# Altium schematic sheet [9]Battery Managment.SchDoc
size B
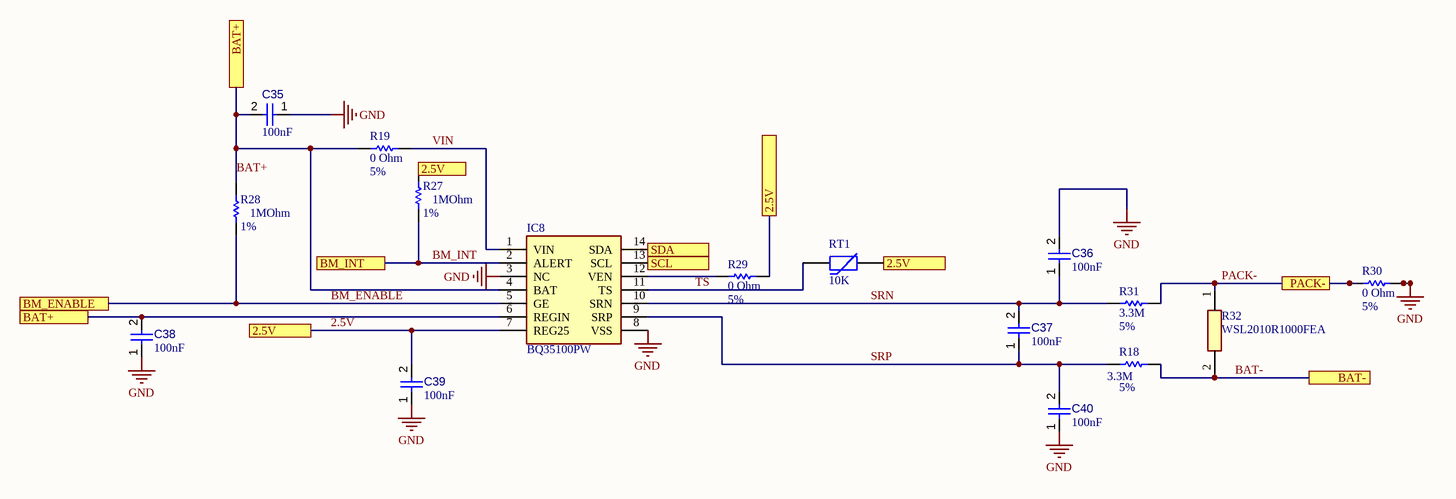
[diagram p0: [9]Battery Managment.SchDoc]

## Parts
C35  value 100nF  [CAPC1608X90X40ML10T20]  (hidden comment: Capacitor 100 nF +/-10% 50 V 0603)
C36  value 100nF  [CAPC1608X90X40ML10T20]  (hidden comment: Capacitor 100 nF +/-10% 50 V 0603)
C37  value 100nF  [CAPC1608X90X40ML10T20]  (hidden comment: Capacitor 100 nF +/-10% 50 V 0603)
C38  value 100nF  [CAPC1608X90X40ML10T20]  (hidden comment: Capacitor 100 nF +/-10% 50 V 0603)
C39  value 100nF  [CAPC1608X90X40ML10T20]  (hidden comment: Capacitor 100 nF +/-10% 50 V 0603)
C40  value 100nF  [CAPC1608X90X40ML10T20]  (hidden comment: Capacitor 100 nF +/-10% 50 V 0603)
IC8  BQ35100PW  [SOP65P640X120-14N]
R18  value 3.3M  Tolerance: 5%  [RES 0603]  (hidden comment: RES 3.3M 5% 0.1W [0603])
R19  value 0 Ohm  Tolerance: 5%  [RES 0603]  (hidden comment: RES 0 Ohm 5% 0.1W [0603])
R27  value 1MOhm  Tolerance: 1%  [RES 0603]  (hidden comment: RES 100K 5% 0.1W [0603])
R28  value 1MOhm  Tolerance: 1%  [RES 0603]  (hidden comment: RES 100K 5% 0.1W [0603])
R29  value 0 Ohm  Tolerance: 5%  [RES 0603]  (hidden comment: RES 0 Ohm 5% 0.1W [0603])
R30  value 0 Ohm  Tolerance: 5%  [RES 0603]  (hidden comment: RES 0 Ohm 5% 0.1W [0603])
R31  value 3.3M  Tolerance: 5%  [RES 0603]  (hidden comment: RES 3.3M 5% 0.1W [0603])
R32  WSL2010R1000FEA  [RESC5025X88N]
RT1  10K  [RESC0603]

## Ports
2.5V, BAT+, BAT-, BM_ENABLE, BM_INT, PACK-, SCL, SDA

## Nets
GND: C35.1 C36.2 C38.1 C39.1 C40.1 IC8.3(NC) IC8.8(VSS) R30.2
2.5V: C39.2 IC8.7(REG25) R27.2 R29.2 RT1.2 ; port 2.5V
BAT+: C35.2 C38.2 IC8.4(BAT) IC8.6(REGIN) R19.1 R28.2 ; port BAT+
BAT-: R18.1 R32.2 ; port BAT-
BM_ENABLE: IC8.5(GE) R28.1 ; port BM_ENABLE
BM_INT: IC8.2(ALERT) R27.1 ; port BM_INT
PACK-: R30.1 R31.1 R32.1 ; port PACK-
SCL: IC8.13(SCL) ; port SCL
SDA: IC8.14(SDA) ; port SDA
SRN: C36.1 C37.2 IC8.10(SRN) R31.2
SRP: C37.1 C40.2 IC8.9(SRP) R18.2
TS: IC8.11(TS) RT1.1
VIN: IC8.1(VIN) R19.2
NetIC8_12: IC8.12(VEN) R29.1

## Library data of the parts
C35-C40 = CMP-001-00017-4: Chip Capacitor, 100 nF, +/- 10%, 50 V, 0603 (1608 Metric); Capacitor Type: Ceramic; Voltage Rating: 50V; RoHS Compliant: True; Max Operating Temperature: 125°C; Pins: 2; Mounting Technology: SM; Min Operating Temperature: -55°C; Tolerance: 10%; Case/Package: 0603
IC8 = BQ35100PW: Integrated Circuit; Manufacturer_Name: Texas Instruments; Datasheet Link: http://www.ti.com/lit/gpn/bq35100; Height: 1.2mm; Manufacturer_Part_Number: BQ35100PW; Arrow Part Number: BQ35100PW; Arrow Price/Stock: https://www.arrow.com/en/products/bq35100pw/texas-instruments; Mouser Part Number: 595-BQ35100PW; Mouser Price/Stock: https://www.mouser.co.uk/ProductDetail/Texas-Instruments/BQ35100PW?qs=Jwe3UnxISIaIuldqtot6tg%3D%3D
R18 R31 = RES 3.3M 1% 0.1W [0603]: PN: CRCW06033M30FKEA; Supplier 1: Digi-Key; Supplier Part Number 1: 541-3.30MHCT-ND
R19 R29 R30 = RES 0 Ohm [0603]: PN: ERJ-3GEY0R00V; Supplier 1: Mouser; Supplier Part Number 1: 667-ERJ-3GEY0R00V; Datasheet: http://industrial.panasonic.com/cdbs/www-data/pdf/RDA0000/AOA0000C301.pdf?src-supplier=Farnell
R27 R28 = RES 1M 1% 0.1W [0603]: PN: CR0603-FX-1004ELF; Supplier 1: Mouser; Supplier Part Number 1: 652-CR0603FX-1004ELF; Datasheet: https://uk.rs-online.com/webdocs/0fcd/0900766b80fcdb72.pdf?src-supplier=RSComponents; Power: 0.1W
R32 = WSL2010R0100FEA: Resistor; Manufacturer_Name: Vishay; Datasheet Link: http://componentsearchengine.com/Datasheets/1/WSL2010R0100FEA.pdf; Manufacturer_Part_Number: WSL2010R0100FEA; Mouser Part Number: 71-WSL2010R0100FEA; Mouser Price/Stock: https://www.mouser.co.uk/ProductDetail/Vishay-Dale/WSL2010R0100FEA?qs=vgLn9hCS5y9zV4J1uLqJFA%3D%3D; Arrow Part Number: WSL2010R0100FEA; Arrow Price/Stock: https://www.arrow.com/en/products/wsl2010r0100fea/vishay
RT1 = ERT-J1VG103JA: NTC THERMISTOR 10K OHM 5% 0603; Manufacturer: Panasonic Electronic Components; B Value Tolerance: ±1%; B25/50: 3375K; B25/85: 3435K; Supplier 1: Digi-Key; Manufacturer Part Number: ERT-J1VG103JA; RoHS: RoHS Compliant; Category: Sensors, Transducers; Stock 1: 76880; Pricing 1: 1=0.32, 5=0.314, 10=0.278, 25=0.2568, 50=0.2052, 100=0.176, 500=0.15392, 1000=0.13193 (CAD); Packaging: Cut Tape (CT); Part Status: Active; Resistance in Ohms @ 25°C: 10k; Resistance Tolerance: ±5%; B0/50: -; B25/75: -; B25/100: -; Operating Temperature: -40°C ~ 125°C; Length - Lead Wire: -; Mounting Type: Surface Mount; Package / Case: 0603 (1608 Metric); ComponentLink1URL: http://industrial.panasonic.com/www-cgi/jvcr13pz.cgi?E+PZ+3+AUA0001+ERTJ1VG103JA+7+WW; ComponentLink1Description: http://industrial.panasonic.com/www-cgi/jvcr13pz.cgi?E+PZ+3+AUA0001+ERTJ1VG103JA+7+WW; Supplier Part Number 1: P12014CT-ND